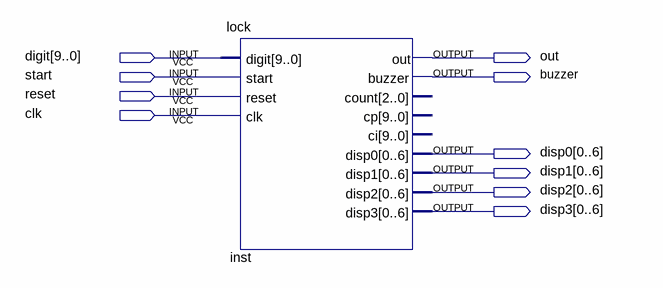
[diagram p0: schematic sheet]
// Quartus schematic lock_block.bdf as structural Verilog: 1 symbols, 10 pins
module lock_block (
  input  [9:0] digit,
  input  start,
  input  reset,
  input  clk,
  output out,
  output buzzer,
  output [0:6] disp0,
  output [0:6] disp1,
  output [0:6] disp2,
  output [0:6] disp3
);

  lock inst (
    .digit(digit), .start(start), .reset(reset), .clk(clk), .out(out), .buzzer(buzzer), .disp0(disp0),
    .disp1(disp1), .disp2(disp2), .disp3(disp3));  // open: count, cp, ci
endmodule
